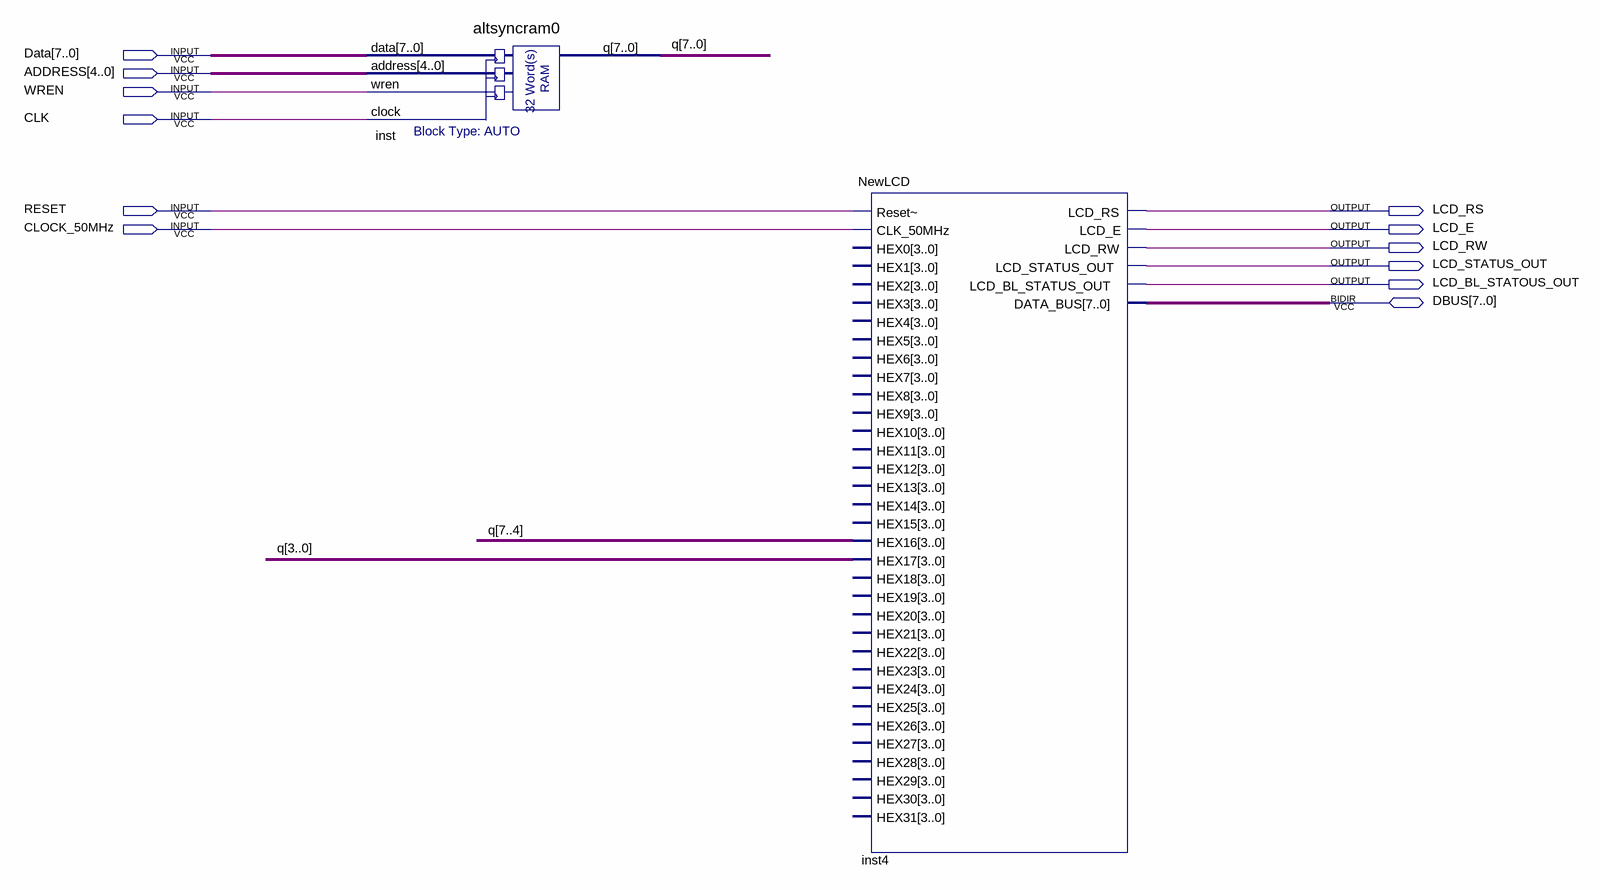
[diagram p0: schematic sheet]
// Quartus schematic ALTSYNCRAM12.bdf as structural Verilog: 2 symbols, 12 pins
module ALTSYNCRAM12 (
  input  [7:0] Data,
  input  [4:0] ADDRESS,
  input  WREN,
  input  CLK,
  input  RESET,
  input  CLOCK_50MHz,
  inout  [7:0] DBUS,
  output LCD_RS,
  output LCD_E,
  output LCD_RW,
  output LCD_STATUS_OUT,
  output LCD_BL_STATOUS_OUT
);

  wire [7:0] q;

  altsyncram0 inst (.data(Data), .address(ADDRESS), .wren(WREN), .clock(CLK), .q(q));
  NewLCD inst4 (
    .\Reset~ (RESET), .CLK_50MHz(CLOCK_50MHz), .HEX16(q[7:4]), .HEX17(q[3:0]), .LCD_RS(LCD_RS),
    .LCD_E(LCD_E), .LCD_RW(LCD_RW), .LCD_STATUS_OUT(LCD_STATUS_OUT), .LCD_BL_STATUS_OUT(LCD_BL_STATOUS_OUT),
    .DATA_BUS(DBUS));  // open: HEX0, HEX1, HEX2, HEX3, HEX4, HEX5, HEX6, HEX7, HEX8, HEX9, HEX10, HEX11, HEX12, HEX13, HEX14, HEX15, HEX18, HEX19, HEX20, HEX21, HEX22, HEX23, HEX24, HEX25, HEX26, HEX27, HEX28, HEX29, HEX30, HEX31
endmodule
